# EAGLE schematic io-board-c-8 (EAGLE 8.4.3)
AUTHOR: Balazs Racz; DOCUMENT_NUMBER: none; DRAWING_TITLE: OpenLCB IO Board for Nucleo; LICENSE: [placeholder for license]; REVISION: A; YEAR: 2018
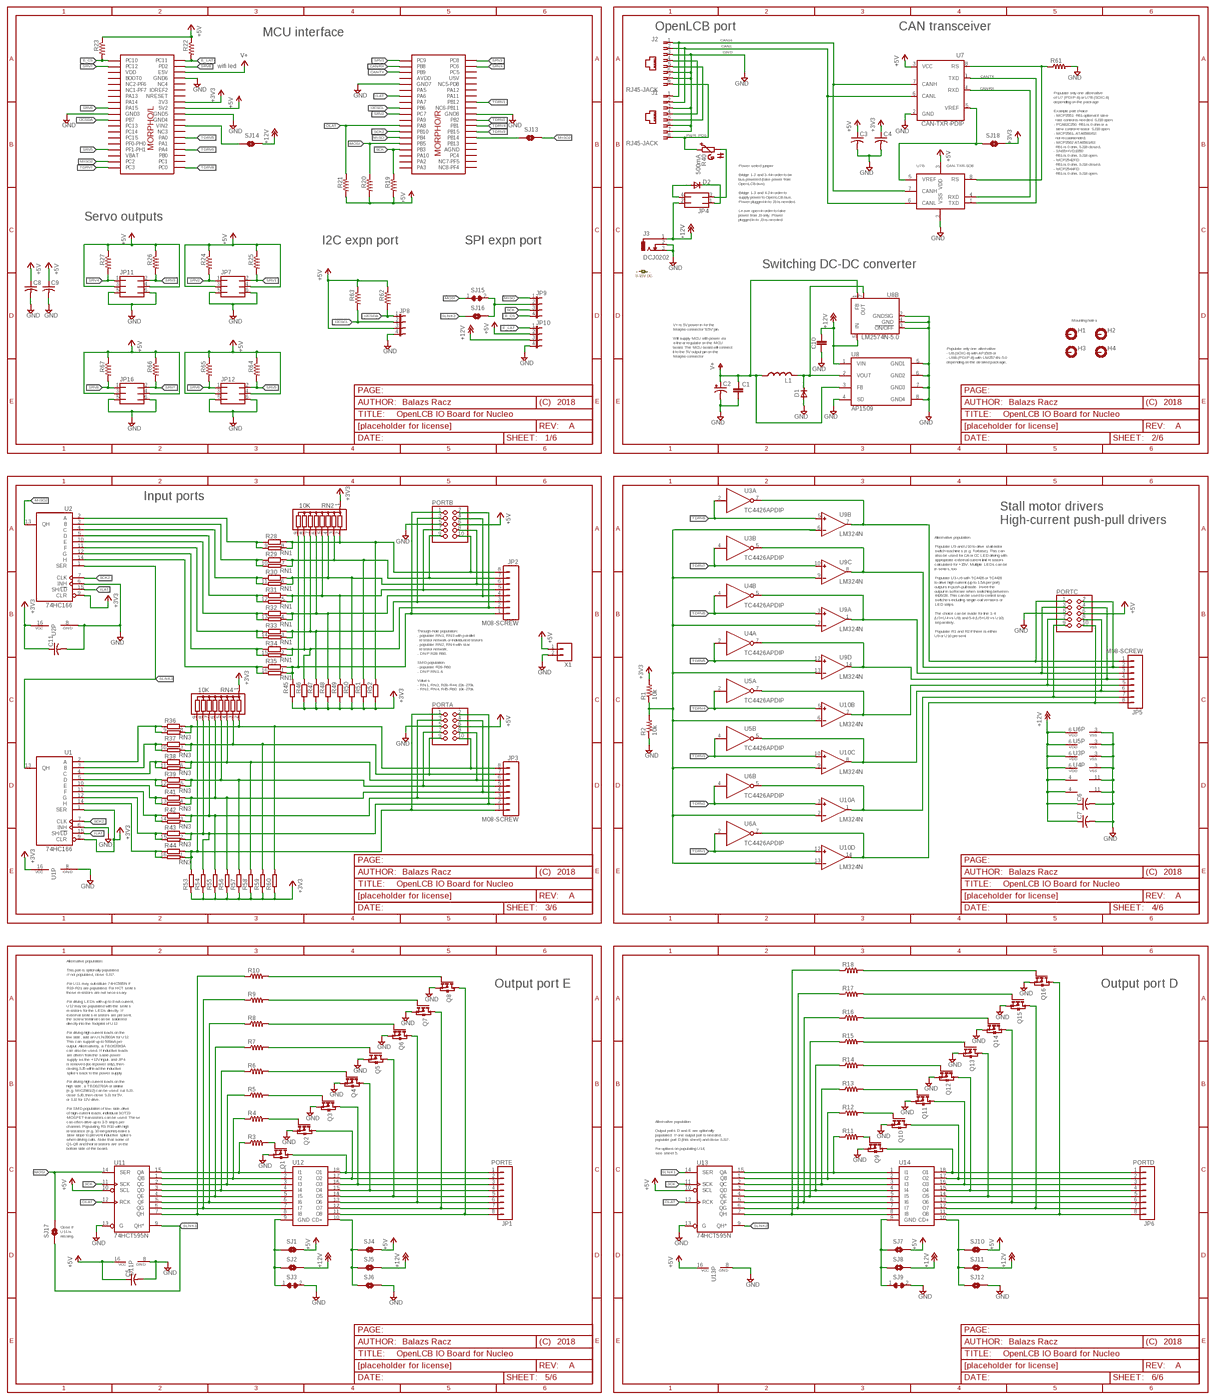
[diagram p0: schematic, sheet 1, overview]
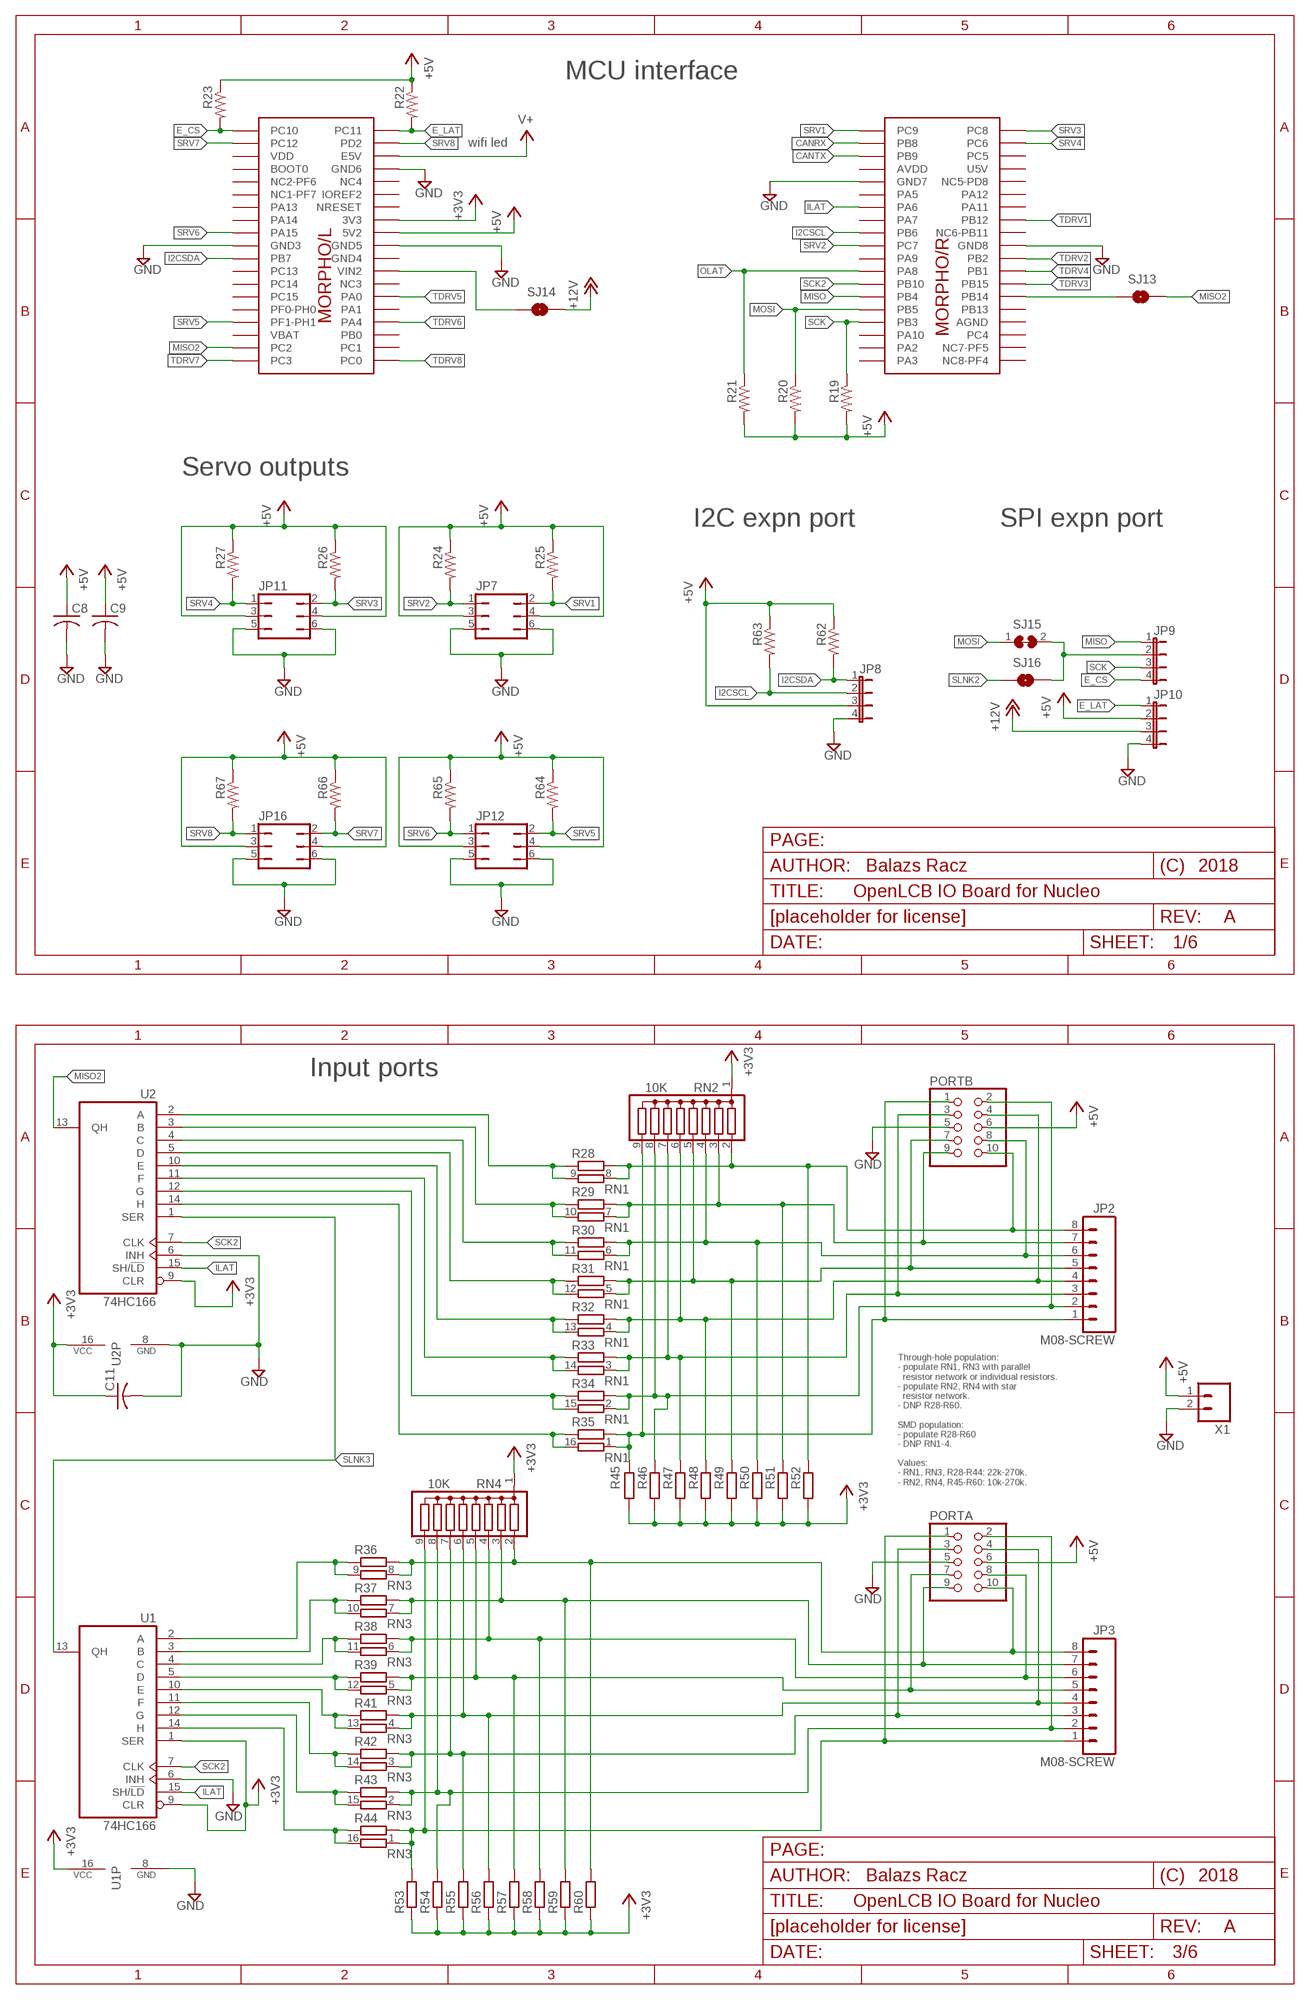
[diagram p1: schematic, sheet 1, part 1 of 4]
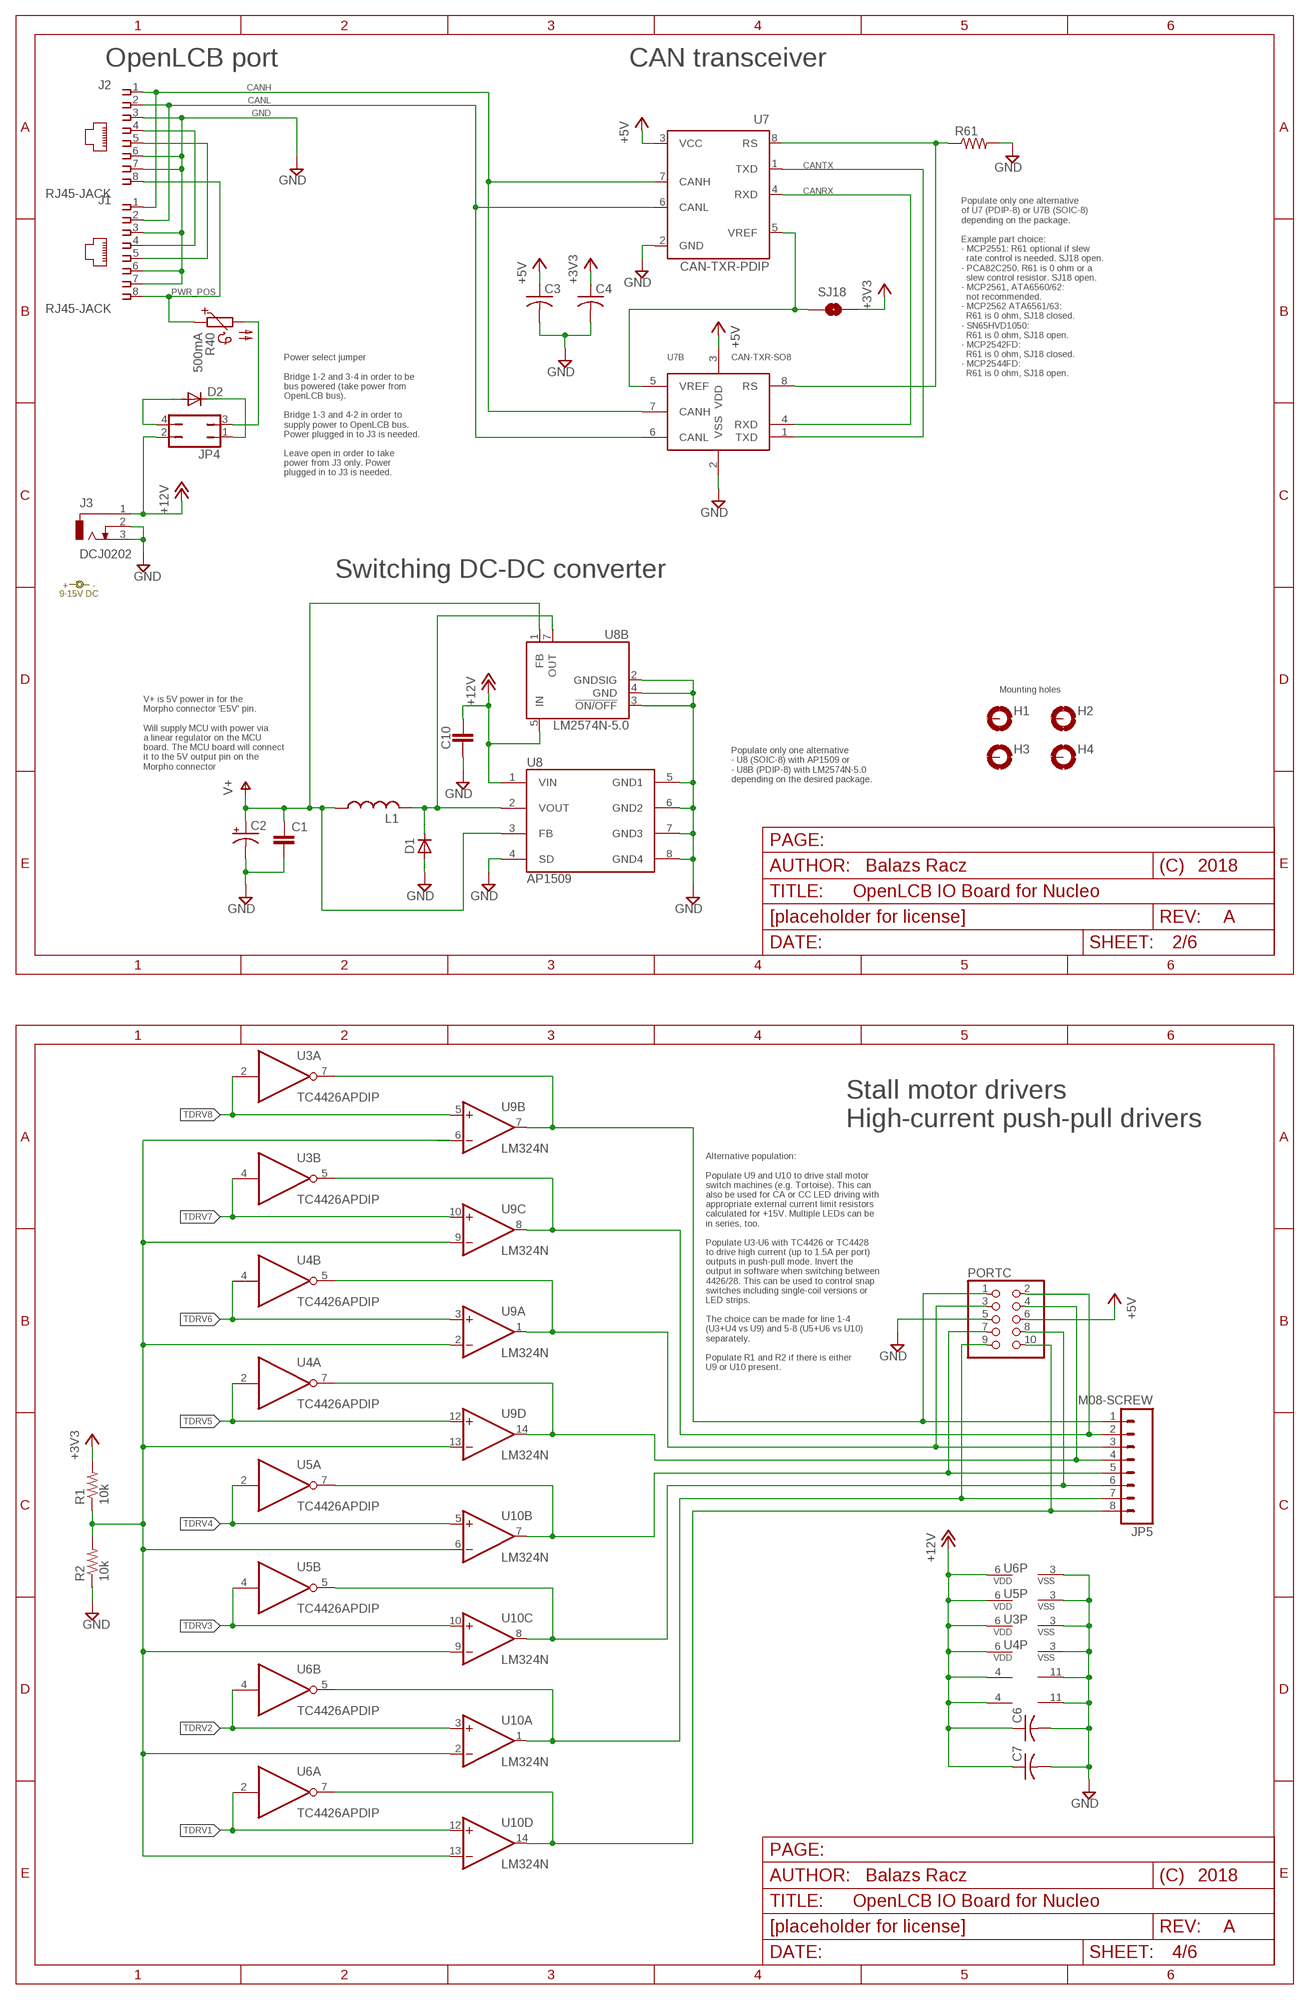
[diagram p2: schematic, sheet 1, part 2 of 4]
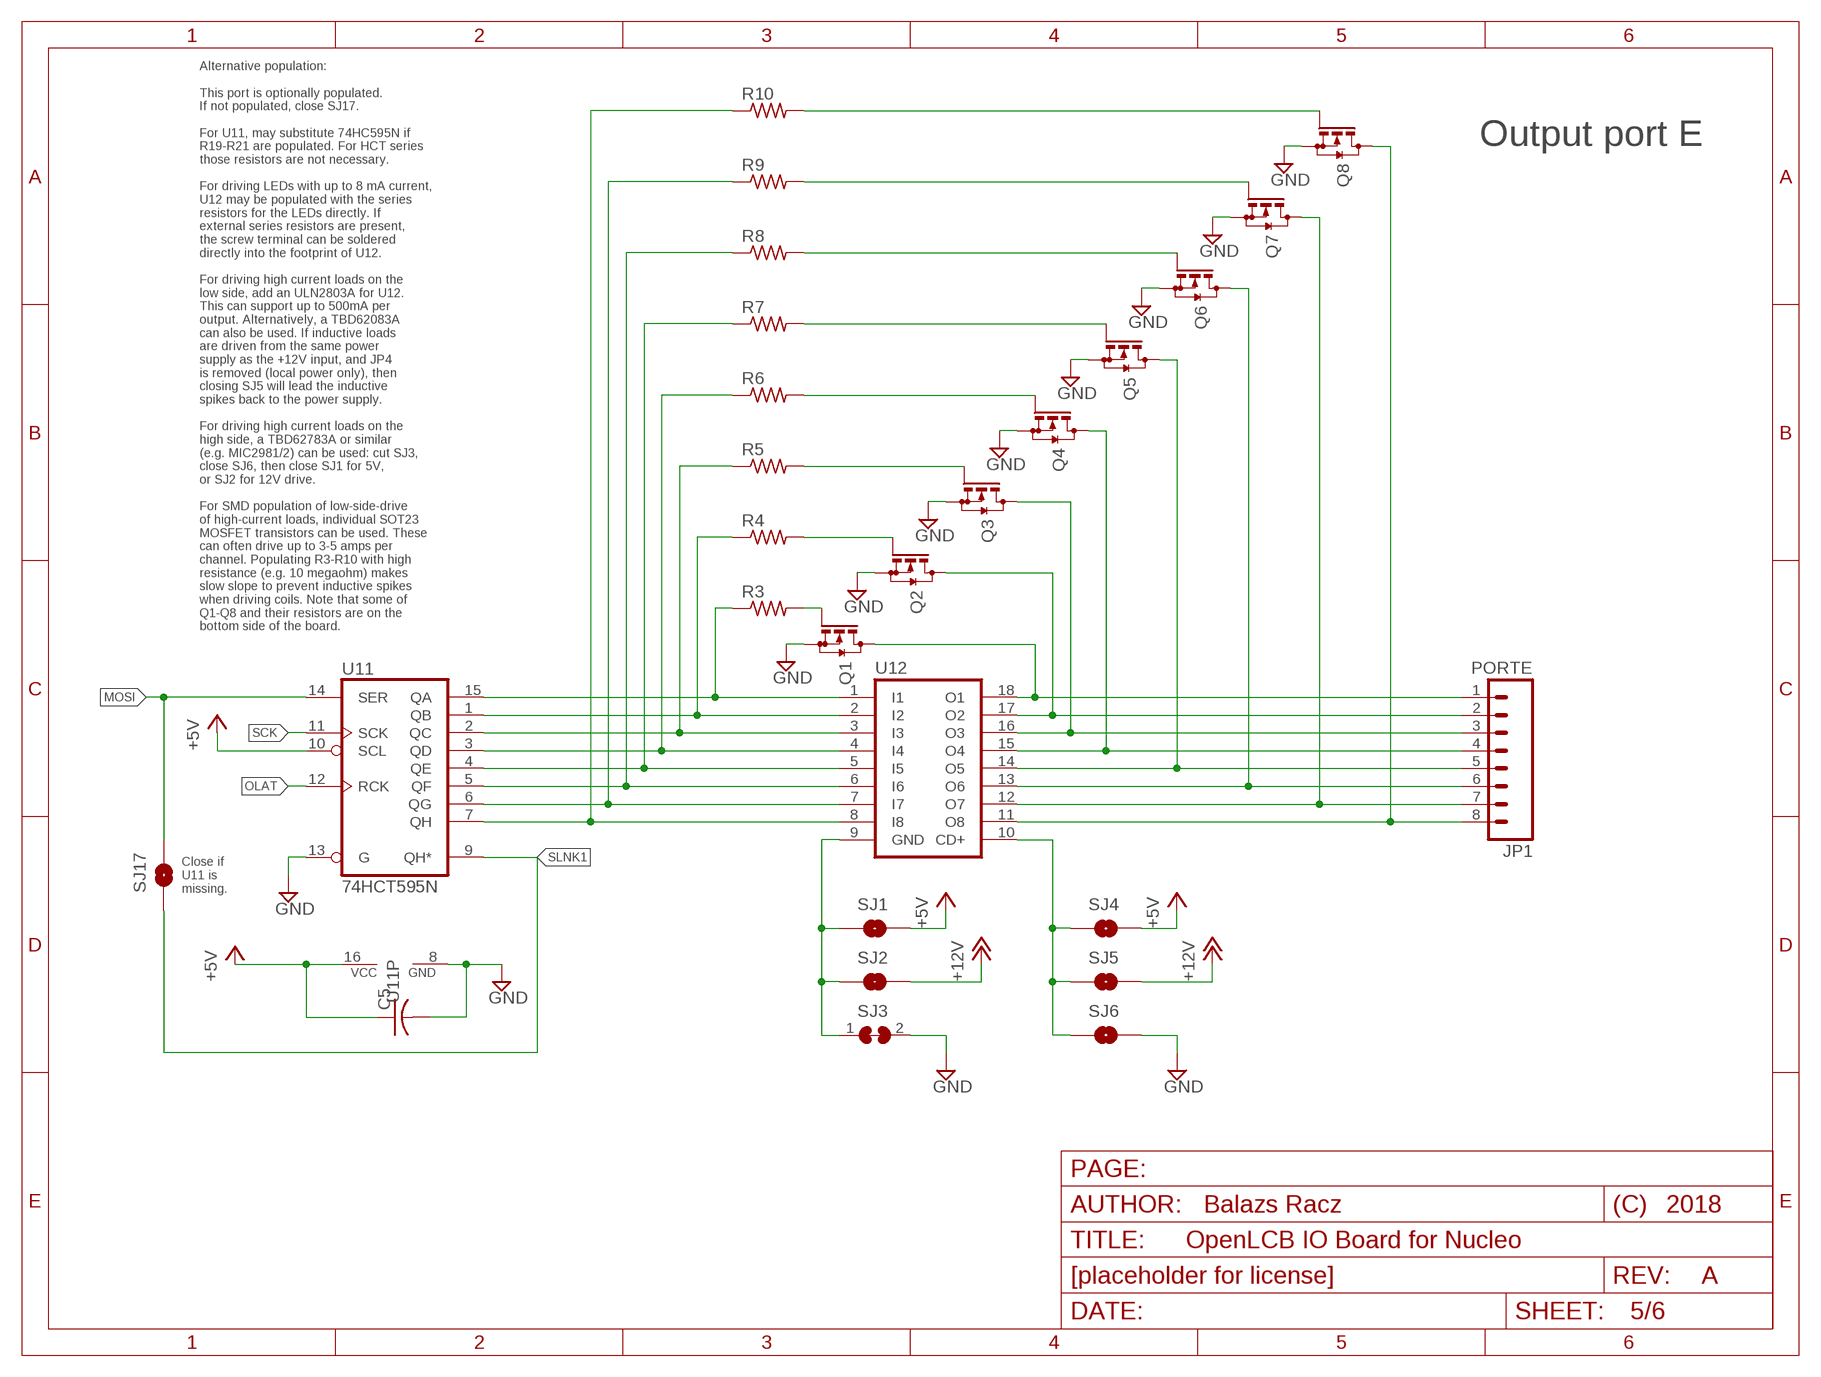
[diagram p3: schematic, sheet 1, part 3 of 4]
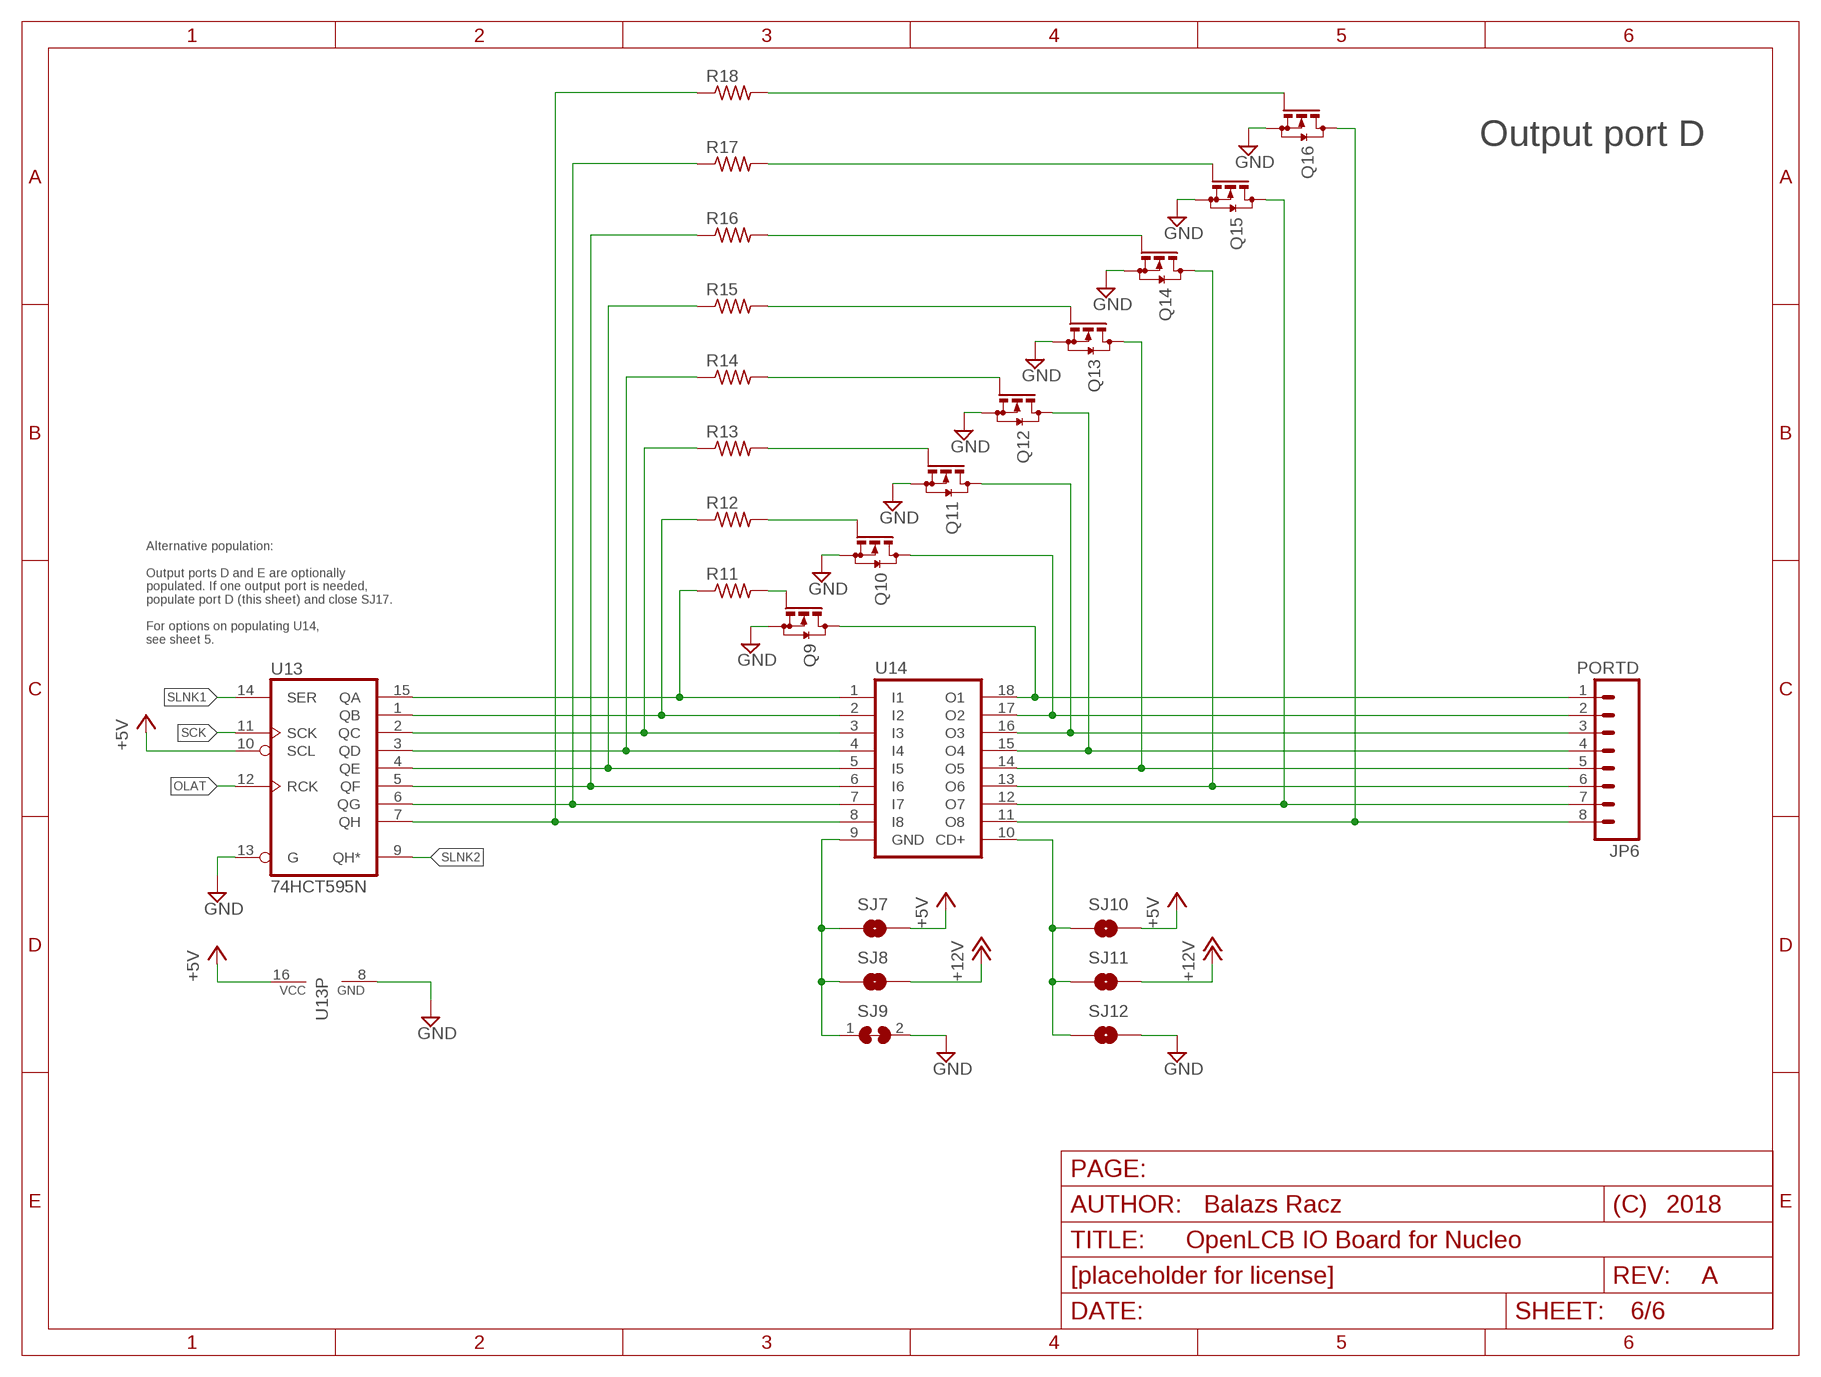
[diagram p4: schematic, sheet 1, part 4 of 4]
FRAME1 (FRAME_A_L): PAGE: MCU interface, servo outputs, expansion port
FRAME2 (FRAME_A_L): PAGE: CAN-bus, power
FRAME3 (FRAME_A_L): PAGE: Input ports
FRAME4 (FRAME_A_L): PAGE: Tortoise drivers and high current drivers
FRAME5 (FRAME_A_L): PAGE: Output port E
FRAME6 (FRAME_A_L): PAGE: Output port D

## Parts
+12V  9-15V DC  DOC-POWER_LABEL  [POWER_USAGE]
C1  C-EUC1206  [C1206]
C2  CPOL-USE2.5-5  [E2,5-5]
C3  C-USC0805  [C0805]
C4  C-USC0805  [C0805]
C5  C-USC0805  [C0805]
C6  C-USC1206  [C1206]
C7  C-USC1206  [C1206]
C8  C-USC1206  [C1206]
C9  C-USC1206  [C1206]
C10  C-EUC1206  [C1206]
C11  C-USC0805  [C0805]
D1  DIODE-DO41-7.6  [DO41-7.6]
D2  DIODE-DO41-7.6  [DO41-7.6]
H1  MOUNT-PAD-ROUND3.3  [3,3-PAD]
H2  MOUNT-PAD-ROUND3.3  [3,3-PAD]
H3  MOUNT-PAD-ROUND3.3  [3,3-PAD]
H4  MOUNT-PAD-ROUND3.3  [3,3-PAD]
J1  RJ45-JACK  RJ45-JACKRJ45-PULSE-E5J00  [RJ45-PULSE-E5J88]
J2  RJ45-JACK  RJ45-JACKRJ45-PULSE-E5J00  [RJ45-PULSE-E5J88]
J3  DCJ0202  [DCJ0202]
JP1  PORTE  M08-SCREW  [1X08_TERMINAL]
JP2  M08-SCREW  [1X08_TERMINAL]
JP3  M08-SCREW  [1X08_TERMINAL]
JP4  JP2Q  [JP2Q]
JP5  M08-SCREW  [1X08_TERMINAL]
JP6  PORTD  M08-SCREW  [1X08_TERMINAL]
JP7  JP3Q  [JP3Q]
JP8  JP4-FLAT  [JP4F]
JP9  JP4-FLAT  [JP4F]
JP10  JP4-FLAT  [JP4F]
JP11  JP3Q  [JP3Q]
JP12  JP3Q  [JP3Q]
JP16  JP3Q  [JP3Q]
L1  L-US  [L5-8,5]
PORTA  PINHD-2X5CN  [CON10M]
PORTB  PINHD-2X5CN  [CON10M]
PORTC  PINHD-2X5CN  [CON10M]
Q1  BSS123  [SOT23]
Q2  BSS123  [SOT23]
Q3  BSS123  [SOT23]
Q4  BSS123  [SOT23]
Q5  BSS123  [SOT23]
Q6  BSS123  [SOT23]
Q7  BSS123  [SOT23]
Q8  BSS123  [SOT23]
Q9  BSS123  [SOT23]
Q10  BSS123  [SOT23]
Q11  BSS123  [SOT23]
Q12  BSS123  [SOT23]
Q13  BSS123  [SOT23]
Q14  BSS123  [SOT23]
Q15  BSS123  [SOT23]
Q16  BSS123  [SOT23]
R1  10k  R-US_R0805  [R0805]
R2  10k  R-US_R0805  [R0805]
R3  R-US_R0603  [R0603]
R4  R-US_R0603  [R0603]
R5  R-US_R0603  [R0603]
R6  R-US_R0603  [R0603]
R7  R-US_R0603  [R0603]
R8  R-US_R0603  [R0603]
R9  R-US_R0603  [R0603]
R10  R-US_R0603  [R0603]
R11  R-US_R0603  [R0603]
R12  R-US_R0603  [R0603]
R13  R-US_R0603  [R0603]
R14  R-US_R0603  [R0603]
R15  R-US_R0603  [R0603]
R16  R-US_R0603  [R0603]
R17  R-US_R0603  [R0603]
R18  R-US_R0603  [R0603]
R19  R-US_R0805  [R0805]
R20  R-US_R0805  [R0805]
R21  R-US_R0805  [R0805]
R22  R-US_R0805  [R0805]
R23  R-US_R0805  [R0805]
R24  R-US_R0805  [R0805]
R25  R-US_R0805  [R0805]
R26  R-US_R0805  [R0805]
R27  R-US_R0805  [R0805]
R28  R-EU_R0603  [R0603]
R29  R-EU_R0603  [R0603]
R30  R-EU_R0603  [R0603]
R31  R-EU_R0603  [R0603]
R32  R-EU_R0603  [R0603]
R33  R-EU_R0603  [R0603]
R34  R-EU_R0603  [R0603]
R35  R-EU_R0603  [R0603]
R36  R-EU_R0603  [R0603]
R37  R-EU_R0603  [R0603]
R38  R-EU_R0603  [R0603]
R39  R-EU_R0603  [R0603]
R40  500mA  PTC_1812  [PTC1812]
R41  R-EU_R0603  [R0603]
R42  R-EU_R0603  [R0603]
R43  R-EU_R0603  [R0603]
R44  R-EU_R0603  [R0603]
R45  R-EU_R0603  [R0603]
R46  R-EU_R0603  [R0603]
R47  R-EU_R0603  [R0603]
R48  R-EU_R0603  [R0603]
R49  R-EU_R0603  [R0603]
R50  R-EU_R0603  [R0603]
R51  R-EU_R0603  [R0603]
R52  R-EU_R0603  [R0603]
R53  R-EU_R0603  [R0603]
R54  R-EU_R0603  [R0603]
R55  R-EU_R0603  [R0603]
R56  R-EU_R0603  [R0603]
R57  R-EU_R0603  [R0603]
R58  R-EU_R0603  [R0603]
R59  R-EU_R0603  [R0603]
R60  R-EU_R0603  [R0603]
R61  R-US_R0805  [R0805]
R62  R-US_R0805  [R0805]
R63  R-US_R0805  [R0805]
R64  R-US_R0805  [R0805]
R65  R-US_R0805  [R0805]
R66  R-US_R0805  [R0805]
R67  R-US_R0805  [R0805]
RN1  8R-P  [DIL16]
RN2  10K  G08R  [SIL9]
RN3  8R-P  [DIL16]
RN4  10K  G08R  [SIL9]
SJ1  SJRND2  [SJ_RND2]
SJ2  SJRND2  [SJ_RND2]
SJ3  SJ-C  [SJW-C]
SJ4  SJRND2  [SJ_RND2]
SJ5  SJRND2  [SJ_RND2]
SJ6  SJRND2  [SJ_RND2]
SJ7  SJRND2  [SJ_RND2]
SJ8  SJRND2  [SJ_RND2]
SJ9  SJ-C  [SJW-C]
SJ10  SJRND2  [SJ_RND2]
SJ11  SJRND2  [SJ_RND2]
SJ12  SJRND2  [SJ_RND2]
SJ13  SJRND2  [SJ_RND2]
SJ14  SJRND2  [SJ_RND2]
SJ15  SJ-C  [SJW-C]
SJ16  SJRND2  [SJ_RND2]
SJ17  SJRND2  [SJ_RND2]
SJ18  SJRND2  [SJ_RND2]
U1  74HC166  74166N  [DIL16]
U2  74HC166  74166N  [DIL16]
U3  TC4426APDIP  [DIL08-LONG]
U4  TC4426APDIP  [DIL08-LONG]
U5  TC4426APDIP  [DIL08-LONG]
U6  TC4426APDIP  [DIL08-LONG]
U7  CAN-TXR-PDIP  PCA82C250  [DIL08]
U7B  CAN-TXR-SO8  MCP2551-SN  [SO-08]
U8  AP1509  [SO-08]
U8B  LM2574N-5.0  [DIL08]
U9  LM324N  [DIL14]
U10  LM324N  [DIL14]
U11  74HCT595N  [DIL16]
U12  ULN2803A  [DIL18-THIN]
U13  74HCT595N  [DIL16]
U14  ULN2803A  [DIL18-THIN]
U$1  NUCLEO_64_GENERIC  [NUCLEO_BRD_BASE64]
X1  CONNECTOR-M023.5MM-LOCK  [SCREWTERMINAL-3.5MM-2_LOCK]

## Nets
+3V3: C4.1 C11.1 R1.2 R45.1 R46.2 R47.2 R48.2 R49.2 R50.2 R51.2 R52.2 R53.1 R54.1 R55.1 R56.1 R57.1 R58.1 R59.1 R60.1 RN2.1 RN4.1 SJ18.P$1 U1.1(SER) U1.9(CLR) U1.16(VCC) U2.9(CLR) U2.16(VCC) U$1.3V3
+5V: C3.1 C5.1 C8.1 C9.1 JP7.3 JP7.4 JP8.3 JP10.2 JP11.3 JP11.4 JP12.3 JP12.4 JP16.3 JP16.4 PORTA.6 PORTB.6 PORTC.6 R19.2 R20.2 R21.2 R22.1 R23.1 R24.1 R25.1 R26.1 R27.1 R62.1 R63.1 R64.1 R65.1 R66.1 R67.1 SJ1.P$2 SJ4.P$2 SJ7.P$2 SJ10.P$2 U7.3(VCC) U7B.3(VDD) U11.10(SCL) U11.16(VCC) U13.10(SCL) U13.16(VCC) U$1.5V2 X1.1
+12V: C6.1 C7.1 C10.1 J3.1 JP4.2 JP10.3 SJ2.P$2 SJ5.P$2 SJ8.P$2 SJ11.P$2 SJ14.P$2 U3.6(P:VDD) U4.6(P:VDD) U5.6(P:VDD) U6.6(P:VDD) U8.1(VIN) U8B.5(IN) U9.4(P:V+) U10.4(P:V+)
CAN_RS: R61.1 U7.8(RS) U7B.8(RS)
CAN_VIO: SJ18.P$2 U7.5(VREF) U7B.5(VREF)
CANH: J1.1 J2.1 U7.7(CANH) U7B.7(CANH)
CANL: J1.2 J2.2 U7.6(CANL) U7B.6(CANL)
CANRX: U7.4(RXD) U7B.4(RXD) U$1.PB8
CANTX: U7.1(TXD) U7B.1(TXD) U$1.PB9
CMPREF: R1.1 R2.2 U9.2(A:-IN) U9.6(B:-IN) U9.9(C:-IN) U9.13(D:-IN) U10.2(A:-IN) U10.6(B:-IN) U10.9(C:-IN) U10.13(D:-IN)
E_CS: JP9.4 R23.2 U$1.PC10
E_LAT: JP10.1 R22.2 U$1.PC11
E_MOSI: JP9.2 SJ15.2 SJ16.P$2
GND: C1.2 C2.- C3.2 C4.2 C5.2 C6.2 C7.2 C8.2 C9.2 C10.2 C11.2 D1.A J1.3 J1.6 J1.7 J2.3 J2.6 J2.7 J3.2 J3.3 JP7.5 JP7.6 JP8.4 JP10.4 JP11.5 JP11.6 JP12.5 JP12.6 JP16.5 JP16.6 PORTA.5 PORTB.5 PORTC.5 Q1.2(S) Q2.2(S) Q3.2(S) Q4.2(S) Q5.2(S) Q6.2(S) Q7.2(S) Q8.2(S) Q9.2(S) Q10.2(S) Q11.2(S) Q12.2(S) Q13.2(S) Q14.2(S) Q15.2(S) Q16.2(S) R2.1 R61.2 SJ3.2 SJ6.P$2 SJ9.2 SJ12.P$2 U1.6(INH) U1.8(GND) U2.6(INH) U2.8(GND) U3.3(P:VSS) U4.3(P:VSS) U5.3(P:VSS) U6.3(P:VSS) U7.2(GND) U7B.2(VSS) U8.4(SD) U8.5(GND1) U8.6(GND2) U8.7(GND3) U8.8(GND4) U8B.2(GNDSIG) U8B.3(!ON/OFF) U8B.4(GND) U9.11(P:V-) U10.11(P:V-) U11.8(GND) U11.13(G) U13.8(GND) U13.13(G) U$1.GND3 U$1.GND5 U$1.GND6 U$1.GND7 U$1.GND8 X1.2
I2CSCL: JP8.2 R63.2 U$1.PB6
I2CSDA: JP8.1 R62.2 U$1.PB7
ILAT: U1.15(SH/!LD) U2.15(SH/!LD) U$1.PA6
LPOWA: SJ7.P$1 SJ8.P$1 SJ9.1 U14.9(GND)
LPOWB: SJ10.P$1 SJ11.P$1 SJ12.P$1 U14.10(CD+)
MISO: JP9.1 U$1.PB4
MISO2: SJ13.P$2 U2.13(QH) U$1.PC2
MISO2_ALT: SJ13.P$1 U$1.PB14
MOSI: R20.1 SJ15.1 SJ17.P$2 U11.14(SER) U$1.PB5
N$1: R3.1 U11.15(QA) U12.1(I1)
N$2: JP1.1 Q1.3(D) U12.18(O1)
N$3: R4.1 U11.1(QB) U12.2(I2)
N$4: J1.4 J2.4
N$5: J1.5 J2.5
N$6: JP3.8 PORTA.10 R36.2 R60.2 RN3.8 RN4.2
N$7: JP1.2 Q2.3(D) U12.17(O2)
N$8: R5.1 U11.2(QC) U12.3(I3)
N$9: JP1.3 Q3.3(D) U12.16(O3)
N$10: R6.1 U11.3(QD) U12.4(I4)
N$11: JP1.4 Q4.3(D) U12.15(O4)
N$12: R7.1 U11.4(QE) U12.5(I5)
N$13: JP1.5 Q5.3(D) U12.14(O5)
N$14: JP3.7 PORTA.9 R37.2 R59.2 RN3.7 RN4.3
N$15: JP3.6 PORTA.8 R38.2 R58.2 RN3.6 RN4.4
N$16: Q4.1(G) R6.2
N$17: R8.1 U11.5(QF) U12.6(I6)
N$18: JP1.6 Q6.3(D) U12.13(O6)
N$19: JP3.4 PORTA.4 R41.2 R56.2 RN3.4 RN4.6
N$20: JP3.3 PORTA.3 R42.2 R55.2 RN3.3 RN4.7
N$21: JP2.6 PORTB.8 R30.2 R50.1 RN1.6 RN2.4
N$22: JP3.1 PORTA.1 R44.2 R53.2 RN3.1 RN4.9
N$23: R36.1 RN3.9 U1.2(A)
N$24: R37.1 RN3.10 U1.3(B)
N$25: JP2.8 PORTB.10 R28.2 R52.1 RN1.8 RN2.2
N$26: JP2.7 PORTB.9 R29.2 R51.1 RN1.7 RN2.3
N$27: Q5.1(G) R7.2
N$28: JP2.5 PORTB.7 R31.2 R49.1 RN1.5 RN2.5
N$29: R38.1 RN3.11 U1.4(C)
N$30: R39.1 RN3.12 U1.5(D)
N$31: R41.1 RN3.13 U1.10(E)
N$32: R42.1 RN3.14 U1.11(F)
N$33: JP2.4 PORTB.4 R32.2 R48.1 RN1.4 RN2.6
N$34: JP2.3 PORTB.3 R33.2 R47.1 RN1.3 RN2.7
N$35: JP2.2 PORTB.2 R34.2 R46.1 RN1.2 RN2.8
N$36: JP2.1 PORTB.1 R35.2 R45.2 RN1.1 RN2.9
N$37: R43.1 RN3.15 U1.12(G)
N$38: R44.1 RN3.16 U1.14(H)
N$39: R9.1 U11.6(QG) U12.7(I7)
N$40: JP1.7 Q7.3(D) U12.12(O7)
N$41: R10.1 U11.7(QH) U12.8(I8)
N$42: JP1.8 Q8.3(D) U12.11(O8)
N$43: Q6.1(G) R8.2
N$44: R28.1 RN1.9 U2.2(A)
N$45: D2.C JP4.1
N$46: D2.A JP4.4
N$47: R29.1 RN1.10 U2.3(B)
N$48: R30.1 RN1.11 U2.4(C)
N$49: R31.1 RN1.12 U2.5(D)
N$50: R32.1 RN1.13 U2.10(E)
N$51: R33.1 RN1.14 U2.11(F)
N$52: R34.1 RN1.15 U2.12(G)
N$53: R35.1 RN1.16 U2.14(H)
N$56: R11.1 U13.15(QA) U14.1(I1)
N$57: JP4.3 R40.2
N$60: SJ14.P$1 U$1.VIN2
N$65: Q7.1(G) R9.2
N$75: JP6.8 Q16.3(D) U14.11(O8)
N$78: Q1.1(G) R3.2
N$79: Q2.1(G) R4.2
N$83: JP3.5 PORTA.7 R39.2 R57.2 RN3.5 RN4.5
N$84: JP3.2 PORTA.2 R43.2 R54.2 RN3.2 RN4.8
N$85: Q8.1(G) R10.2
N$87: JP6.1 Q9.3(D) U14.18(O1)
N$88: Q3.1(G) R5.2
N$89: R12.1 U13.1(QB) U14.2(I2)
N$91: JP6.2 Q10.3(D) U14.17(O2)
N$92: R13.1 U13.2(QC) U14.3(I3)
N$93: JP6.3 Q11.3(D) U14.16(O3)
N$94: R14.1 U13.3(QD) U14.4(I4)
N$95: JP6.4 Q12.3(D) U14.15(O4)
N$96: R15.1 U13.4(QE) U14.5(I5)
N$97: JP6.5 Q13.3(D) U14.14(O5)
N$98: R16.1 U13.5(QF) U14.6(I6)
N$99: JP6.6 Q14.3(D) U14.13(O6)
N$100: R17.1 U13.6(QG) U14.7(I7)
N$101: JP6.7 Q15.3(D) U14.12(O7)
N$102: R18.1 U13.7(QH) U14.8(I8)
N$104: Q9.1(G) R11.2
N$105: Q10.1(G) R12.2
N$106: Q11.1(G) R13.2
N$107: Q12.1(G) R14.2
N$108: Q13.1(G) R15.2
N$109: Q14.1(G) R16.2
N$110: Q15.1(G) R17.2
N$111: Q16.1(G) R18.2
OLAT: R21.1 U11.12(RCK) U13.12(RCK) U$1.PA8
PWR_POS: J1.8 J2.8 R40.1
RPOWA: SJ1.P$1 SJ2.P$1 SJ3.1 U12.9(GND)
RPOWB: SJ4.P$1 SJ5.P$1 SJ6.P$1 U12.10(CD+)
SCK: JP9.3 R19.1 U11.11(SCK) U13.11(SCK) U$1.PB3
SCK2: U1.7(CLK) U2.7(CLK) U$1.PB10
SLNK1: SJ17.P$1 U11.9(QH*) U13.14(SER)
SLNK2: SJ16.P$1 U13.9(QH*)
SLNK3: U1.13(QH) U2.1(SER)
SRV1: JP7.2 R25.2 U$1.PC9
SRV2: JP7.1 R24.2 U$1.PC7
SRV3: JP11.2 R26.2 U$1.PC8
SRV4: JP11.1 R27.2 U$1.PC6
SRV5: JP12.2 R64.2 U$1.PF1-PH1
SRV6: JP12.1 R65.2 U$1.PA15
SRV7: JP16.2 R66.2 U$1.PC12
SRV8: JP16.1 R67.2 U$1.PD2
SW: D1.C L1.2 U8.2(VOUT) U8B.7(OUT)
TDRV1: U6.2(A:I) U10.12(D:+IN) U$1.PB12
TDRV2: U6.4(B:I) U10.3(A:+IN) U$1.PB2
TDRV3: U5.4(B:I) U10.10(C:+IN) U$1.PB15
TDRV4: U5.2(A:I) U10.5(B:+IN) U$1.PB1
TDRV5: U4.2(A:I) U9.12(D:+IN) U$1.PA0
TDRV6: U4.4(B:I) U9.3(A:+IN) U$1.PA4
TDRV7: U3.4(B:I) U9.10(C:+IN) U$1.PC3
TDRV8: U3.2(A:I) U9.5(B:+IN) U$1.PC0
TOUT1: JP5.1 PORTC.1 U3.7(A:O) U9.7(B:OUT)
TOUT2: JP5.2 PORTC.2 U3.5(B:O) U9.8(C:OUT)
TOUT3: JP5.3 PORTC.3 U4.5(B:O) U9.1(A:OUT)
TOUT4: JP5.4 PORTC.4 U4.7(A:O) U9.14(D:OUT)
TOUT5: JP5.5 PORTC.7 U5.7(A:O) U10.7(B:OUT)
TOUT6: JP5.6 PORTC.8 U5.5(B:O) U10.8(C:OUT)
TOUT7: JP5.7 PORTC.9 U6.5(B:O) U10.1(A:OUT)
TOUT8: JP5.8 PORTC.10 U6.7(A:O) U10.14(D:OUT)
V+: C1.1 C2.+ L1.1 U8.3(FB) U8B.1(FB) U$1.E5V
Unconnected: H1.B3,3(MOUNT) H2.B3,3(MOUNT) H3.B3,3(MOUNT) H4.B3,3(MOUNT) U$1.BOOT0 U$1.IOREF2 U$1.NC1-PF7 U$1.NC2-PF6 U$1.NC3 U$1.NC4 U$1.NC5-PD8 U$1.NC6-PB11 U$1.NC7-PF5 U$1.NC8-PF4 U$1.NRESET U$1.PA1 U$1.PA2 U$1.PA3 U$1.PA5 U$1.PA7 U$1.PA9 U$1.PA10 U$1.PA11 U$1.PA12 U$1.PA13 U$1.PA14 U$1.PB0 U$1.PB13 U$1.PC1 U$1.PC4 U$1.PC5 U$1.PC13 U$1.PC14 U$1.PC15 U$1.PF0-PH0

## Notes on the sheet
- OpenLCB port | CAN transceiver
- MCU interface
- wifi led
- Populate only one alternative 
  of U7 (PDIP-8) or U7B (SOIC-8) 
  depending on the package.
  
  Example part choice:
  - MCP2551: R61 optional if slew 
    rate control is needed. SJ18 open.
  - PCA82C250. R61 is 0 ohm or a 
    slew control resistor. SJ18 open.
  - MCP2561, ATA6560/62:
    not recommended.
  - MCP2562 ATA6561/63: 
    R61 is 0 ohm, SJ18 closed.
  - SN65HVD1050: 
    R61 is 0 ohm, SJ18 open.
  - MCP2542FD:
    R61 is 0 ohm, SJ18 closed.
  - MCP2544FD:
    R61 is 0 ohm, SJ18 open.
- Servo outputs
- Power select jumper
  
  Bridge 1-2 and 3-4 in order to be
  bus powered (take power from 
  OpenLCB bus).
  
  Bridge 1-3 and 4-2 in order to
  supply power to OpenLCB bus.
  Power plugged in to J3 is needed.
  
  Leave open in order to take 
  power from J3 only. Power 
  plugged in to J3 is needed.
- I2C expn port | SPI expn port
- Switching DC-DC converter
- Mounting holes
- V+ is 5V power in for the
  Morpho connector 'E5V' pin.
  
  Will supply MCU with power via
  a linear regulator on the MCU 
  board. The MCU board will connect
  it to the 5V output pin on the
  Morpho connector
- Populate only one alternative 
  - U8 (SOIC-8) with AP1509 or
  - U8B (PDIP-8) with LM2574N-5.0
  depending on the desired package.
- Input ports
- Stall motor drivers
  High-current push-pull drivers
- Alternative population:
  
  Populate U9 and U10 to drive stall motor
  switch machines (e.g. Tortoise). This can
  also be used for CA or CC LED driving with
  appropriate external current limit resistors
  calculated for +15V. Multiple LEDs can be
  in series, too.
  
  Populate U3-U6 with TC4426 or TC4428
  to drive high current (up to 1.5A per port)
  outputs in push-pull mode. Invert the
  output in software when switching between
  4426/28. This can be used to control snap
  switches including single-coil versions or 
  LED strips.
  
  The choice can be made for line 1-4 
  (U3+U4 vs U9) and 5-8 (U5+U6 vs U10)
  separately.
  
  Populate R1 and R2 if there is either
  U9 or U10 present.
- Through-hole population:
  - populate RN1, RN3 with parallel
    resistor network or individual resistors.
  - populate RN2, RN4 with star
    resistor network.
  - DNP R28-R60.
  
  SMD population:
  - populate R28-R60
  - DNP RN1-4.
  
  Values:
  - RN1, RN3, R28-R44: 22k-270k.
  - RN2, RN4, R45-R60: 10k-270k.
- Output port E | Output port D
- Alternative population:
  
  This port is optionally populated.
  If not populated, close SJ17.
  
  For U11, may substitute 74HC595N if
  R19-R21 are populated. For HCT series
  those resistors are not necessary.
  
  For driving LEDs with up to 8 mA current,
  U12 may be populated with the series
  resistors for the LEDs directly. If
  external series resistors are present,
  the screw terminal can be soldered
  directly into the footprint of U12.
  
  For driving high current loads on the
  low side, add an ULN2803A for U12.
  This can support up to 500mA per
  output. Alternatively, a TBD62083A 
  can also be used. If inductive loads
  are driven from the same power 
  supply as the +12V input, and JP4
  is removed (local power only), then
  closing SJ5 will lead the inductive
  spikes back to the power supply.
  
  For driving high current loads on the
  high side, a TBD62783A or similar
  (e.g. MIC2981/2) can be used: cut SJ3, 
  close SJ6, then close SJ1 for 5V, 
  or SJ2 for 12V drive.
  
  For SMD population of low-side-drive
  of high-current loads, individual SOT23
  MOSFET transistors can be used. These
  can often drive up to 3-5 amps per
  channel. Populating R3-R10 with high
  resistance (e.g. 10 megaohm) makes
  slow slope to prevent inductive spikes
  when driving coils. Note that some of
  Q1-Q8 and their resistors are on the
  bottom side of the board.
- Alternative population:
  
  Output ports D and E are optionally 
  populated. If one output port is needed,
  populate port D (this sheet) and close SJ17.
  
  For options on populating U14,
  see sheet 5.
- Close if
  U11 is
  missing.

## Power pins joined to a net without a drawn wire
AGND: U$1.AGND
AVDD: U$1.AVDD
GND4: U$1.GND4
U5V: U$1.U5V
VBAT: U$1.VBAT
VDD: U$1.VDD

## Library data of the parts
+12V = SPCoast:DOC-POWER_LABEL
C1 C10 = rcl:C-EU: CAPACITOR, European symbol
C2 = rcl:CPOL-US: POLARIZED CAPACITOR, American symbol
C3-C9 C11 = rcl:C-US: CAPACITOR, American symbol
D1 D2 = diode:DIODE-: DIODE
H1-H4 = holes:MOUNT-PAD-ROUND: MOUNTING PAD, round
J1 J2 = trainlib:RJ45-JACK: Mod. Jack, Right Angle, 8 posiotion, 8 contatcs RJ45 Source: GLX-S-88M.pdf
J3 = con-jack:DCJ0202: DC POWER JACK Source: DCJ0202.pdf; OC_FARNELL: unknown; OC_NEWARK: unknown
JP1-JP3 JP5 JP6 = trainlib:M08-SCREW
JP4 = jumper:JP2Q: JUMPER
JP7 JP11 JP12 JP16 = jumper:JP3Q: JUMPER
JP8-JP10 = trainlib:JP4-FLAT: JUMPER
L1 = trainlib:L-US
PORTA PORTB PORTC = trainlib:PINHD-2X5: PIN HEADER
Q1-Q16 = transistor-small-signal:BSS123: N-CHANNEL MOS FET
R1-R27 R61-R67 = rcl:R-US_: RESISTOR, American symbol
R28-R39 R41-R60 = rcl:R-EU_: RESISTOR, European symbol
R40 = tcs:PTC_: PHILIPS PTC
RN1 RN3 = resistor-dil:8R-P: DIL RESISTOR; OC_FARNELL: unknown; OC_NEWARK: unknown
RN2 RN4 = resistor-sil:G08R: SIL RESISTOR; OC_FARNELL: unknown; OC_NEWARK: unknown
SJ1 SJ2 SJ4-SJ8 SJ10-SJ14 SJ16-SJ18 = trainlib:SJ: SMD solder JUMPER
SJ3 SJ9 SJ15 = trainlib:SJ-C
U1 U2 = 74xx-us:74*166: 8-bit parallel load SHIFT REGISTER
U3-U6 = trainlib:TC4426A: The TC4426A (dual inverter), 4427A (dual buffer) and 4428A (buffer+inverter) are improved buffer/drivers. They will not latch up under any conditions within their power and voltage ratings. They are not subject to damage when up to 5V of noise spiking (of either polarity) occurs on the ground pin. They can accept, without damage or logic upset, up to 500 mA of reverse current (of either polarity) being forced back into their outputs. All terminals are fully protected against up to 4 kV of electrostatic discharge. As MOSFET drivers, the TC4426A/4427A/4428A can easily switch 1000 pF gate capacitances in under 30 ns, and provide low enough impedances in both the ON and OFF states to ensure the MOSFET's intended state will not be affected, even by large transients.
U7 = trainlib:PCA82C250: CAN CONTROLLER INTERFACE; OC_FARNELL: 3692358; OC_NEWARK: unknown
U7B = SPCoast:MCP2551: MCP2551 High-Speed CAN Transceiver
U8 = trainlib:AP1509
U8B = linear:LM2574?-*: SIMPLE SWITCHER 0.5A Step-Down Voltage Regulator Source: http://cache.national.com/ds/LM/LM2574.pdf
U9 U10 = linear:LM324: OP AMP
U11 U13 = 74xx-eu:74*595: 8-bit SHIFT REGISTER, output latch
U12 U14 = trainlib:ULN2803A: DRIVER ARRAY
U$1 = trainlib:NUCLEO_64_GENERIC
X1 = SPCoast:CONNECTOR-M02: PHOENIX CONNECTOR